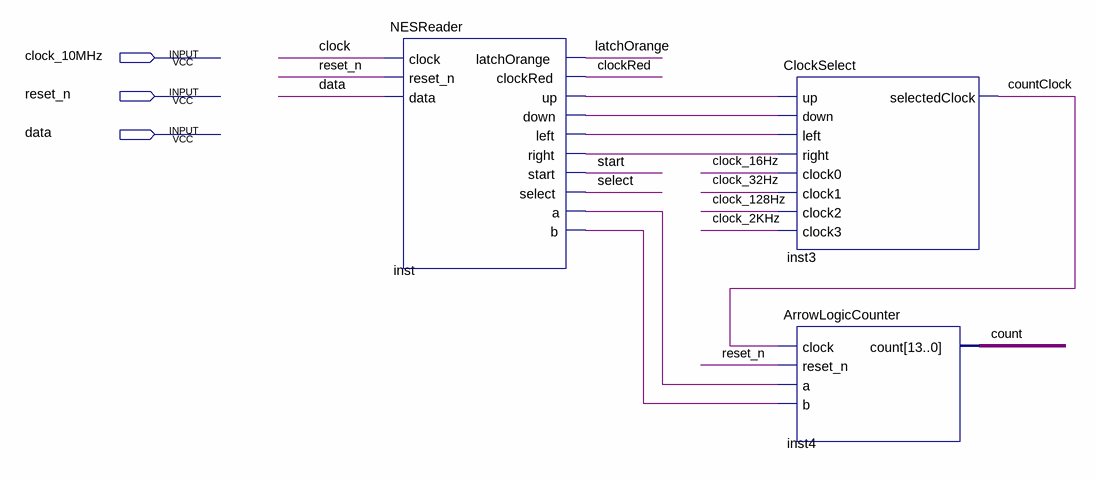
[diagram p0: schematic sheet]
// Quartus schematic NESController.bdf as structural Verilog: 3 symbols, 3 pins
module NESController (
  input  clock_10MHz,
  input  reset_n,
  input  data
);

  wire clock, clock_2KHz, clock_16Hz, clock_32Hz, clock_128Hz, clockRed, count, countClock, inst_a, inst_b,
       inst_down, inst_left, inst_right, inst_up, latchOrange, select, start;

  NESReader inst (
    .clock(clock), .reset_n(reset_n), .data(data), .latchOrange(latchOrange), .clockRed(clockRed),
    .up(inst_up), .down(inst_down), .left(inst_left), .right(inst_right), .start(start), .select(select),
    .a(inst_a), .b(inst_b));
  ClockSelect inst3 (
    .up(inst_up), .down(inst_down), .left(inst_left), .right(inst_right), .clock0(clock_16Hz),
    .clock1(clock_32Hz), .clock2(clock_128Hz), .clock3(clock_2KHz), .selectedClock(countClock));
  ArrowLogicCounter inst4 (.clock(countClock), .reset_n(reset_n), .a(inst_a), .b(inst_b), .count(count));
endmodule
